# EAGLE design LoRa Bee (EAGLE 6.6.0)
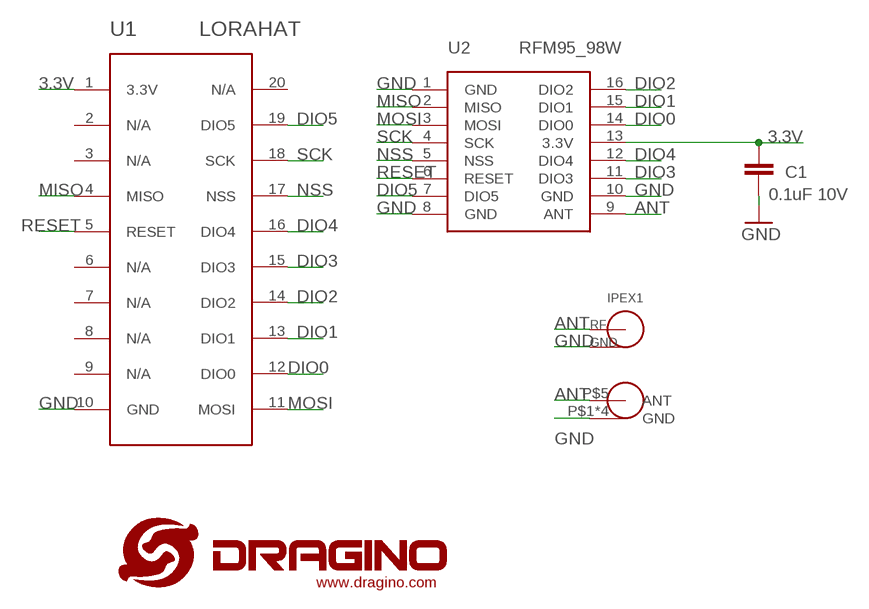
[diagram p0: schematic, sheet 1]

## Parts
C1  0.1uF 10V  C-EUC0402  [C0402]
IPEX1  I-PEX  [I-PEX]
U1  LORAHAT  [LORAHAT]
U2  RFM95_98W  [RFM95_98W]
U$1  LOGO-NEW  [LOGO-SILK-NEW]
X4  SMA-KE  [SMA-KE]

## Nets
3.3V: C1.2 U1.1(3.3V) U2.13(3.3V)
ANT: IPEX1.SIG U2.9(ANT) X4.P$5(ANT)
DIO0: U1.12(DIO0) U2.14(DIO0)
DIO1: U1.13(DIO1) U2.15(DIO1)
DIO2: U1.14(DIO2) U2.16(DIO2)
DIO3: U1.15(DIO3) U2.11(DIO3)
DIO4: U1.16(DIO4) U2.12(DIO4)
DIO5: U1.19(DIO5) U2.7(DIO5)
GND: C1.1 IPEX1.GND IPEX1.GND1(GND) U1.10(GND) U2.1(GND) U2.8(GND) U2.10(GND) X4.P$1(GND) X4.P$2(GND) X4.P$3(GND) X4.P$4(GND)
MISO: U1.4(MISO) U2.2(MISO)
MOSI: U1.11(MOSI) U2.3(MOSI)
NSS: U1.17(NSS) U2.5(NSS)
RESET: U1.5(RESET) U2.6(RESET)
SCK: U1.18(SCK) U2.4(SCK)
Unconnected: U1.2(N/A) U1.3(N/A) U1.6(N/A) U1.7(N/A) U1.8(N/A) U1.9(N/A) U1.20(N/A)

## Library data of the parts
C1 = dragino-passive:C-EU: CAPACITOR, European symbol
IPEX1 = dragino-passive:I-PEX: I-PEX, U.F.L connector
U1 = dragino:LORAHAT
U2 = RFM92_93W:RFM95_98W
U$1 = dragino:LOGO-NEW
X4 = sma-ke:SMA-KE

## Board
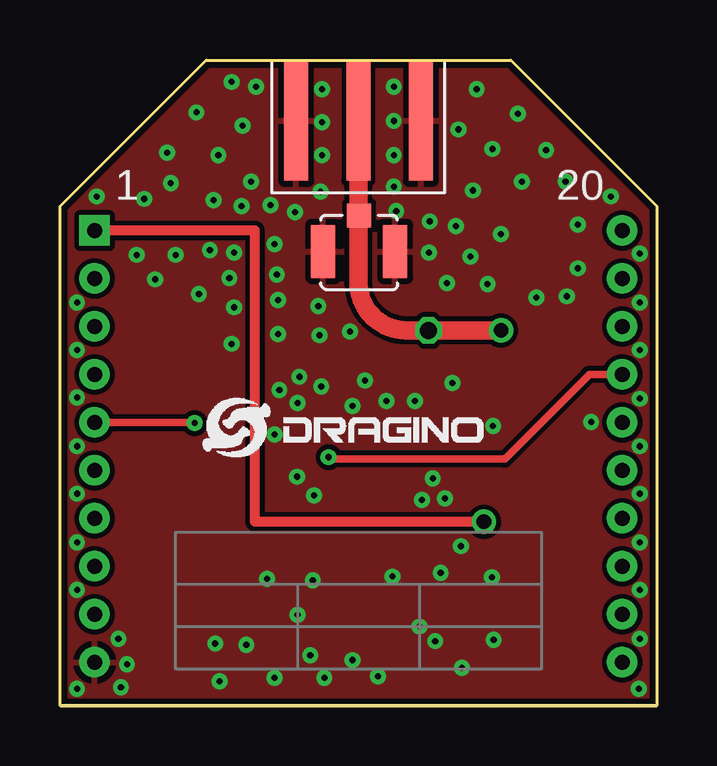
[diagram p1: board, top side]
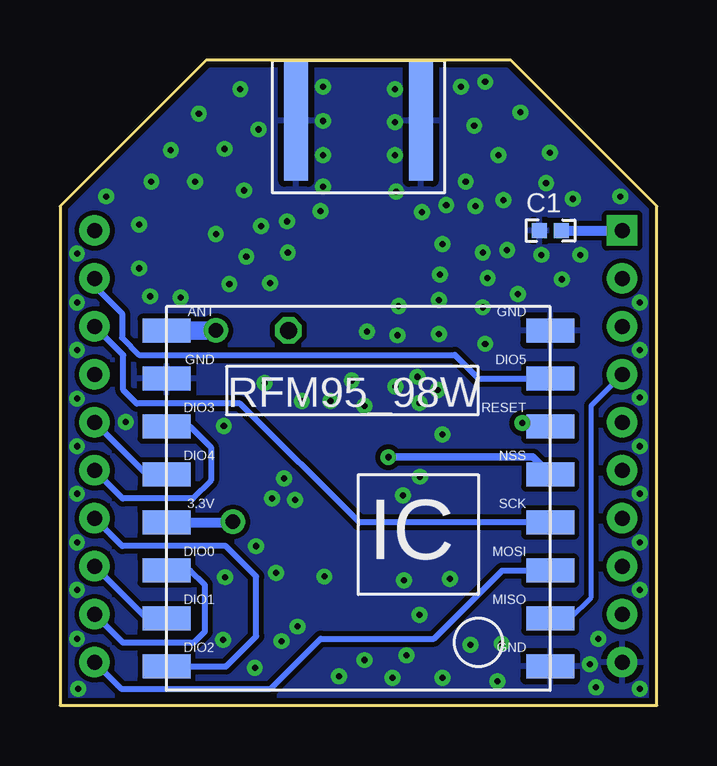
[diagram p2: board, bottom side, seen from below]

Size 24.89 x 26.92 mm. Coordinates in mm from the lower left corner, seen from the top.
Copper layers (1*16): Top 0.035mm / dielectric 1.5mm / Bottom 0.035mm
Design rules "default *": minimum track width 8mil, minimum drill 10mil, track to track 8mil, track to pad 8mil, pad to pad 8mil, via to via 8mil, smd to smd 8mil, copper to edge 10mil, drill to drill 8mil, minimum pad ring 10mil, minimum via ring 8mil, stop-mask expansion 4mil, vias tented up to drill 25mil, thermal gap 10mil

### Footprints (pad centres in the part's own frame; a part is rotated, then mirrored left to right if it is on the bottom)
C0402 = smd 0.61 x 0.61: 1 -0.457,0; 2 0.457,0
I-PEX = smd 1 x 2.2: GND -1.65,-0.27; GND1 1.35,-0.27 | smd 1 x 1: SIG -0.15,-1.77
LORAHAT = drill 0.635 pad 1.27 square: 1 -11,7.62 | drill 0.635 pad 1.27: 2 -11,5.62; 3 -11,3.62; 4 -11,1.62; 5 -11,-0.38; 6 -11,-2.38; 7 -11,-4.38; 8 -11,-6.38; 9 -11,-8.38; 10 -11,-10.38; 11 11,-10.38; 12 11,-8.38; 13 11,-6.38; 14 11,-4.38; 15 11,-2.38; 16 11,-0.38; 17 11,1.62; 18 11,3.62; 19 11,5.62; 20 11,7.62
RFM95_98W = smd 2 x 1: 1 -8,7; 2 -8,5; 3 -8,3; 4 -8,1; 5 -8,-1; 6 -8,-3; 7 -8,-5; 8 -8,-7; 9 8,-7; 10 8,-5; 11 8,-3; 12 8,-1; 13 8,1; 14 8,3; 15 8,5; 16 8,7
SMA-KE = smd 1 x 5: P$1 -2.6,0; P$2 2.6,0; P$5 0,0 | smd 1 x 5 bottom: P$3 -2.6,0; P$4 2.6,0

### Placement (x,y rotation side)
C1  4.44,19.81 0 bottom
IPEX1  12.32,18.67 180 top
U1  12.45,12.19 0 top
U2  12.45,8.64 180 bottom
U$1  5.94,10.36 0 top
X4  12.45,24.38 180 top

### Tracks (layer width: path | path; a pad name or v marks a point on that pad's centre or on a via)
3.3V  (via drill 0.61)
  Top 0.406: v17.68,7.67 8.13,7.67 8.13,19.81 U1.1
  Bottom 0.406: U2.13 17.68,7.64 v17.68,7.67 | C1.2 U1.1
ANT  (via drill 0.61, 0.7)
  Top 0.305: 15.95,15.73 arc90 15.87,15.65
  Top 0.406: 12.45,19.2 12.47,19.2 IPEX1.SIG
  Top 0.762: v18.39,15.65 15.87,15.65 15.75,15.65 v15.37,15.65 14.45,15.65 arc-90 12.45,17.65 12.45,19.2 X4.P$5
  Bottom 0.762: U2.9 v18.39,15.64 v18.39,15.65
DIO0
  Bottom 0.254: U1.12 22.28,2.64 19.3,2.64 18.85,3.1 18.85,5.03 19.46,5.64 U2.14
DIO1
  Bottom 0.254: U1.13 21.27,3.64 U2.15
DIO2
  Bottom 0.254: U2.16 17.97,1.64 16.71,2.9 16.71,5.39 17.98,6.66 22.29,6.66 U1.14
DIO3
  Bottom 0.254: U2.11 19.46,11.64 18.59,10.77 18.59,9.4 19.35,8.64 22.27,8.64 U1.15
DIO4
  Bottom 0.254: U2.12 21.27,9.64 U1.16
DIO5
  Bottom 0.254: U1.19 23.45,17.5 22.3,16.36 22.3,15.34 21.59,14.63 8.43,14.63 7.44,13.64 U2.7
GND  (via drill 0.25)
  other vias: 7.16,26.01 5.69,24.74 4.47,23.06 1.52,21.23 3.51,21.13 6.6,22.96 7.62,24.18 6.4,21.08 7.26,18.9 9.04,17.98 7.98,21.84 3.96,17.78 15.39,18.9 10.92,25.7 10.92,24.33 10.92,22.96 10.87,21.44 9.8,20.57 12.09,15.6 10.77,16.66 10.82,15.44 17.83,17.58 17.12,18.72 16.51,19.99 16.13,17.63 15.42,20.19 14.02,20.62 17.37,25.7 16.61,24.03 18.03,23.22 19.1,24.69 20.27,23.16 21.59,20.07 21.59,18.24 8.94,11.3 14.81,12.7 12.19,12.5 10.9,13.31 6.25,19 13.61,12.7 0.71,4.83 0.71,6.81 2.44,2.79 2.54,0.76 6.65,1.02 8.94,1.17 11.02,1.17 13.26,1.22 7.77,2.54 10.44,2.11 8.64,5.28 10.54,5.23 9.91,3.78 14.99,3.3 16.76,1.57 15.65,2.69 18.01,5.36 18.08,2.74 15.87,5.54 16.71,6.65 13.87,5.38 6.48,2.59 15.09,8.59 18.06,11.66 18.39,19.66 22.15,11.84 24.18,10.82 24.18,12.8 24.18,8.84 24.18,6.81 24.18,4.83 24.18,2.79 8.94,19.25 21.08,21.84 24.18,18.85 21.13,17.07 19.86,17.02 24.18,16.81 24.18,14.83 24.13,0.71 0.71,0.71 2.79,1.73 0.71,10.82 0.71,8.84 0.71,12.85 0.71,14.83 0.71,16.81 8.18,25.81 12.73,13.56 9.88,9.55 9.91,12.62 9.14,13.16 9.09,15.49 7.16,15.09 7.26,16.61 9.09,16.92 7.06,17.83 7.57,20.83 8.79,20.88 4.83,18.8 3.2,18.8 4.62,21.79 10.59,8.76 9.98,13.72 12.19,1.91 5.79,17.17 16.05,8.64 16.36,13.46 15.54,9.47 13.92,24.38 13.92,22.96 13.92,21.64 13.92,25.81 17.22,21.49 19.25,21.84 22.96,21.23
  pour Bottom: -0.05,-0.1 -0.05,20.88 6.1,27.03 18.75,27.03 18.8,27.03 24.99,20.83 24.99,-0.05 24.99,-0.1
  pour Top: -0.05,-0.1 -0.05,20.88 6.1,27.03 18.75,27.03 18.8,27.03 24.99,20.83 24.99,-0.1
MISO
  Bottom 0.203: U2.2 3.63,3.64 2.74,4.52 2.74,12.52 U1.4
MOSI
  Bottom 0.254: U1.11 22.34,0.71 16.1,0.71 14.02,2.79 9.3,2.79 6.45,5.64 U2.3
NSS  (via drill 0.25)
  Top 0.305: U1.17 22.07,13.81 18.54,10.29 11.28,10.29 v11.2,10.36
  Bottom 0.305: 4.48,9.6 U2.5 5.17,10.36 v11.2,10.36
RESET  (via drill 0.25)
  Top 0.305: U1.5 5.59,11.81 v5.61,11.79
  Bottom 0.254: v5.61,11.79 4.45,11.79 U2.6
SCK
  Bottom 0.254: U2.4 12.41,7.64 17.37,12.6 21.69,12.6 22.25,13.16 22.25,14.62 U1.18

### Text on the board
tDocu: LoRa BEE v1.0 | Frequency | 433MHZ | 868MHZ | 915MHZ